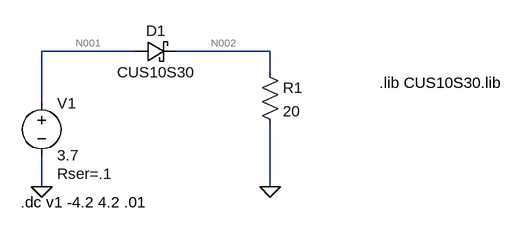
[diagram p0: schematic Battery_with_series_Schottky.asc]
Battery_with_series_Schottky.asc, the LTspice schematic file:
Version 4
SHEET 1 1552 732
WIRE 208 80 64 80
WIRE 416 80 272 80
WIRE 416 112 416 80
WIRE 64 160 64 80
WIRE 64 288 64 240
WIRE 416 288 416 192
FLAG 64 288 0
FLAG 416 288 0
SYMBOL res 400 96 R0
SYMATTR InstName R1
SYMATTR Value 20
SYMBOL voltage 64 144 R0
WINDOW 123 0 0 Left 0
WINDOW 39 24 124 Left 2
SYMATTR SpiceLine Rser=.1
SYMATTR InstName V1
SYMATTR Value 3.7
SYMBOL schottky 208 96 R270
WINDOW 0 32 32 VTop 2
WINDOW 3 0 32 VBottom 2
SYMATTR InstName D1
SYMATTR Value CUS10S30
SYMATTR Prefix X
TEXT 32 312 Left 2 !.dc v1 -4.2 4.2 .01
TEXT 584 128 Left 2 !.lib CUS10S30.lib

The netlist it stands for:
* Battery_with_series_Schottky.asc
R1 N002 0 20
V1 N001 0 3.7 Rser=.1
XD1 N001 N002 CUS10S30  ; pins + -
.dc v1 -4.2 4.2 .01
.lib CUS10S30.lib
.backanno
.end

* Results of the author's LTspice run, read from the files saved beside the schematic
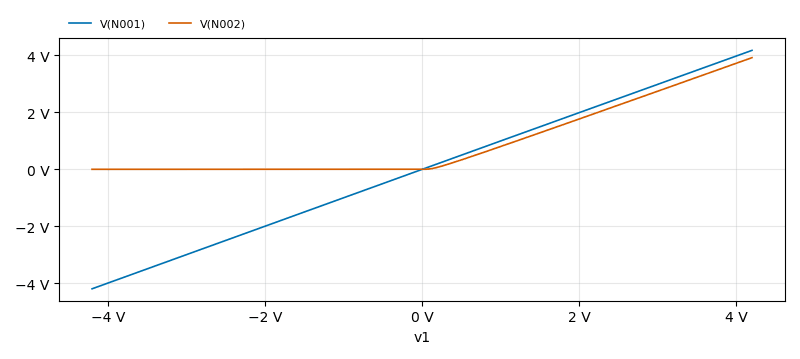
[diagram p1: DC transfer characteristic of Battery_with_series_Schottky.asc, plotted from the saved traces]
* DC transfer characteristic, 1 run:
*   V(N001): -4.2 V at v1=-4.2 V, 4.18 V at v1=4.2 V, min -4.2 V, max 4.18 V
*   V(N002): -429.1 µV at v1=-4.2 V, 3.923 V at v1=4.2 V, min -429.1 µV, max 3.923 V